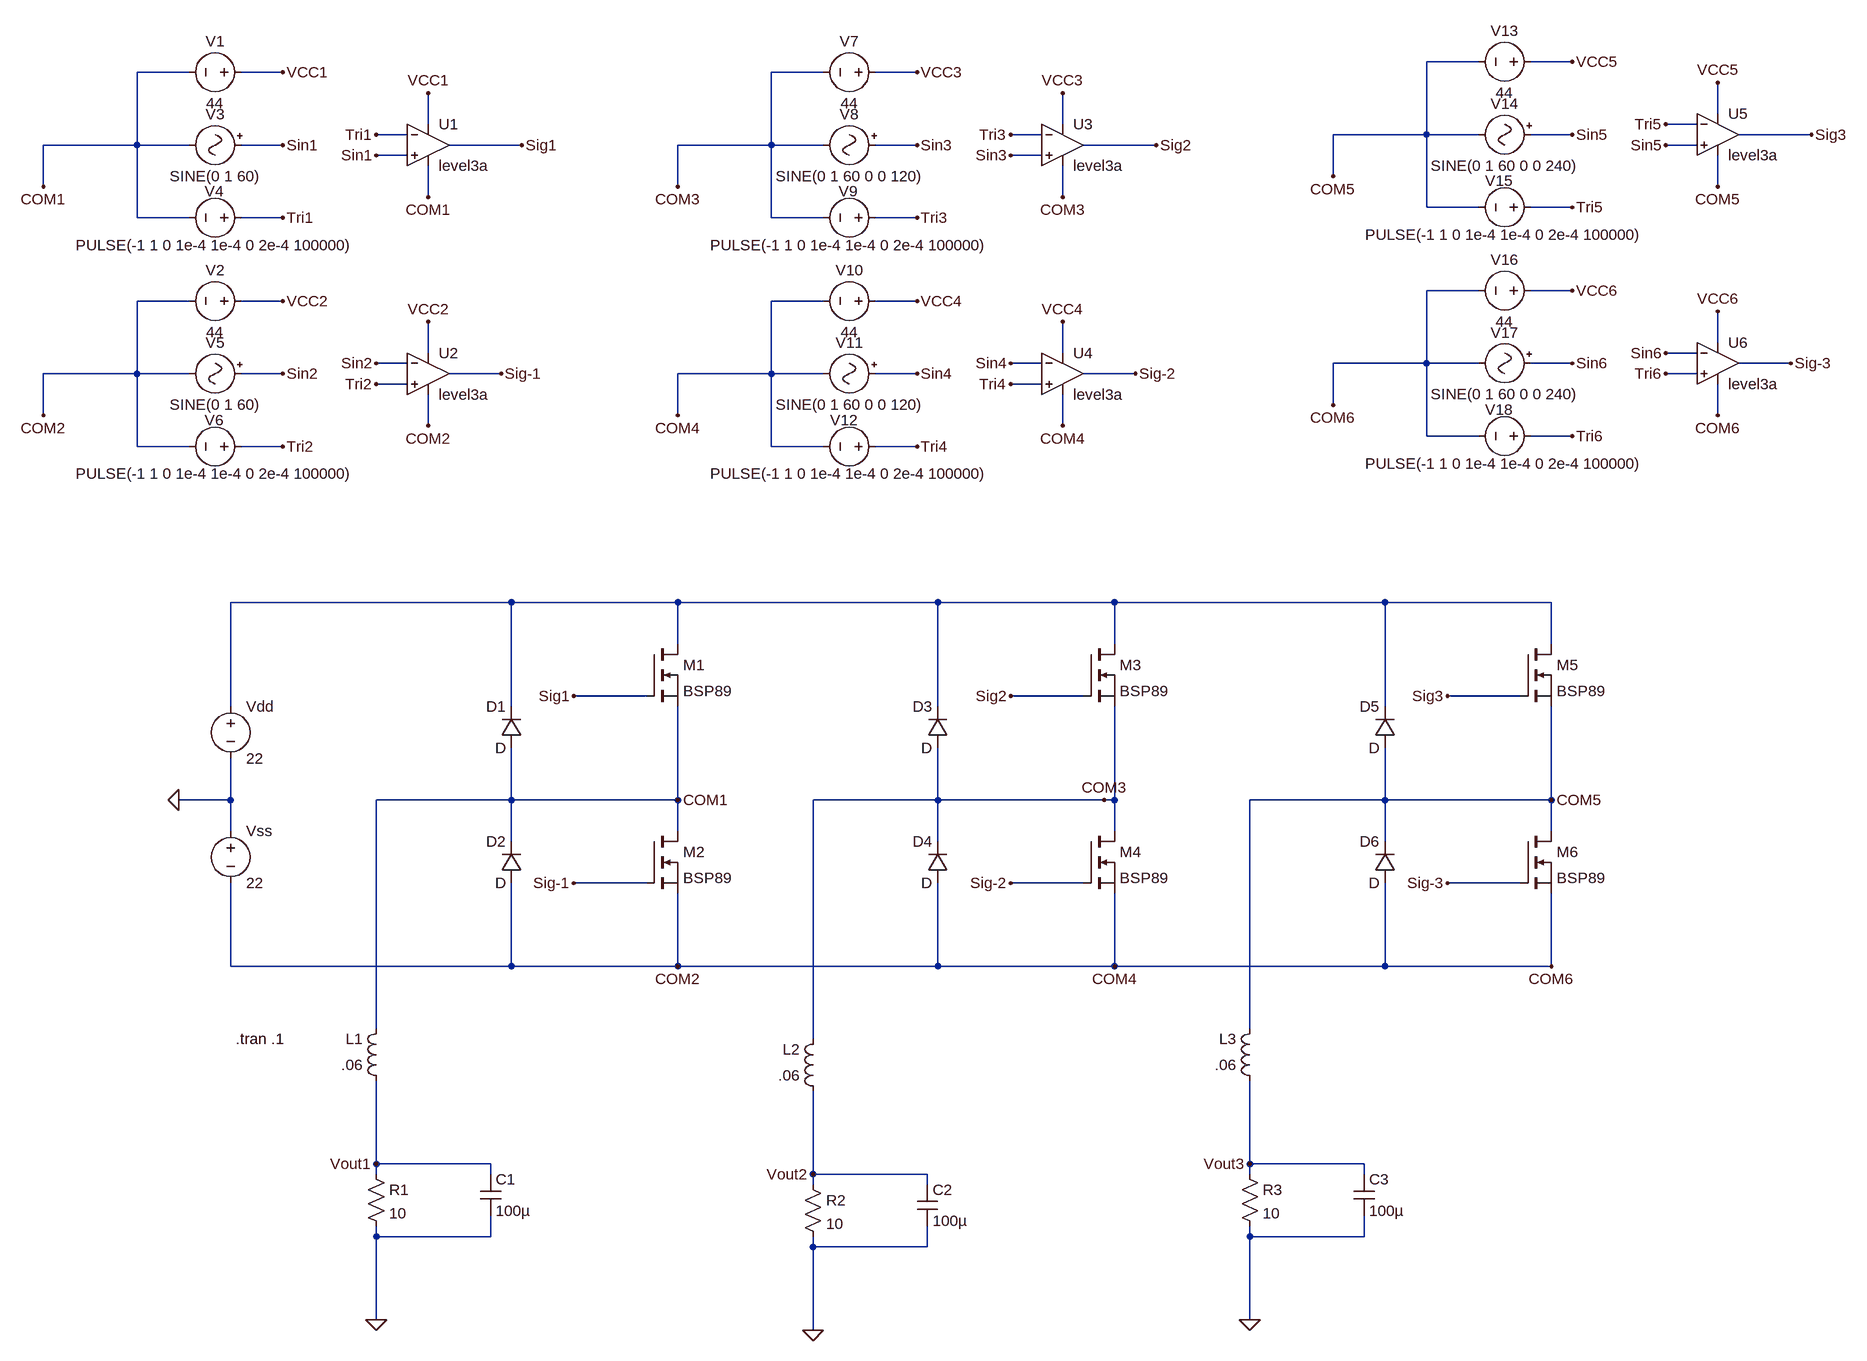
[diagram p0: schematic three_phase_inv.asc]
three_phase_inv.asc, the LTspice schematic file:
Version 4
SHEET 1 2544 2612
WIRE 1824 -528 1744 -528
WIRE 1968 -528 1904 -528
WIRE -160 -512 -240 -512
WIRE -16 -512 -80 -512
WIRE 816 -512 736 -512
WIRE 960 -512 896 -512
WIRE 2192 -448 2192 -496
WIRE 208 -432 208 -480
WIRE 1184 -432 1184 -480
WIRE 2160 -432 2112 -432
WIRE 176 -416 128 -416
WIRE 1152 -416 1104 -416
WIRE 1744 -416 1744 -528
WIRE 1744 -416 1600 -416
WIRE 1824 -416 1744 -416
WIRE 1968 -416 1904 -416
WIRE 2336 -416 2224 -416
WIRE -240 -400 -240 -512
WIRE -240 -400 -384 -400
WIRE -160 -400 -240 -400
WIRE -16 -400 -80 -400
WIRE 352 -400 240 -400
WIRE 736 -400 736 -512
WIRE 736 -400 592 -400
WIRE 816 -400 736 -400
WIRE 960 -400 896 -400
WIRE 1328 -400 1216 -400
WIRE 2160 -400 2112 -400
WIRE 176 -384 128 -384
WIRE 1152 -384 1104 -384
WIRE 1600 -352 1600 -416
WIRE -384 -336 -384 -400
WIRE 592 -336 592 -400
WIRE 2192 -336 2192 -384
WIRE 208 -320 208 -368
WIRE 1184 -320 1184 -368
WIRE 1744 -304 1744 -416
WIRE 1824 -304 1744 -304
WIRE 1968 -304 1904 -304
WIRE -240 -288 -240 -400
WIRE -160 -288 -240 -288
WIRE -16 -288 -80 -288
WIRE 736 -288 736 -400
WIRE 816 -288 736 -288
WIRE 960 -288 896 -288
WIRE 1824 -176 1744 -176
WIRE 1968 -176 1904 -176
WIRE -160 -160 -240 -160
WIRE -16 -160 -80 -160
WIRE 816 -160 736 -160
WIRE 960 -160 896 -160
WIRE 2192 -96 2192 -144
WIRE 208 -80 208 -128
WIRE 1184 -80 1184 -128
WIRE 2160 -80 2112 -80
WIRE 176 -64 128 -64
WIRE 1152 -64 1104 -64
WIRE 1744 -64 1744 -176
WIRE 1744 -64 1600 -64
WIRE 1824 -64 1744 -64
WIRE 1968 -64 1904 -64
WIRE 2304 -64 2224 -64
WIRE -240 -48 -240 -160
WIRE -240 -48 -384 -48
WIRE -160 -48 -240 -48
WIRE -16 -48 -80 -48
WIRE 320 -48 240 -48
WIRE 736 -48 736 -160
WIRE 736 -48 592 -48
WIRE 816 -48 736 -48
WIRE 960 -48 896 -48
WIRE 1296 -48 1216 -48
WIRE 2160 -48 2112 -48
WIRE 176 -32 128 -32
WIRE 1152 -32 1104 -32
WIRE 1600 0 1600 -64
WIRE -384 16 -384 -48
WIRE 592 16 592 -48
WIRE 2192 16 2192 -32
WIRE 208 32 208 -16
WIRE 1184 32 1184 -16
WIRE 1744 48 1744 -64
WIRE 1824 48 1744 48
WIRE 1968 48 1904 48
WIRE -240 64 -240 -48
WIRE -160 64 -240 64
WIRE -16 64 -80 64
WIRE 736 64 736 -48
WIRE 816 64 736 64
WIRE 960 64 896 64
WIRE 336 304 -96 304
WIRE 592 304 336 304
WIRE 992 304 592 304
WIRE 1264 304 992 304
WIRE 1680 304 1264 304
WIRE 1936 304 1680 304
WIRE 592 368 592 304
WIRE 1264 368 1264 304
WIRE 1936 368 1936 304
WIRE 544 448 432 448
WIRE 1216 448 1104 448
WIRE 1888 448 1776 448
WIRE -96 464 -96 304
WIRE 336 464 336 304
WIRE 992 464 992 304
WIRE 1680 464 1680 304
WIRE -96 608 -96 544
WIRE -96 608 -176 608
WIRE 336 608 336 528
WIRE 336 608 128 608
WIRE 592 608 592 464
WIRE 592 608 336 608
WIRE 992 608 992 528
WIRE 992 608 800 608
WIRE 1248 608 992 608
WIRE 1264 608 1264 464
WIRE 1264 608 1248 608
WIRE 1680 608 1680 528
WIRE 1680 608 1472 608
WIRE 1936 608 1936 464
WIRE 1936 608 1680 608
WIRE -96 656 -96 608
WIRE 592 656 592 608
WIRE 1264 656 1264 608
WIRE 1936 656 1936 608
WIRE 336 672 336 608
WIRE 992 672 992 608
WIRE 1680 672 1680 608
WIRE 544 736 432 736
WIRE 1216 736 1104 736
WIRE 1888 736 1776 736
WIRE -96 864 -96 736
WIRE 336 864 336 736
WIRE 336 864 -96 864
WIRE 592 864 592 752
WIRE 592 864 336 864
WIRE 992 864 992 736
WIRE 992 864 592 864
WIRE 1264 864 1264 752
WIRE 1264 864 992 864
WIRE 1680 864 1680 736
WIRE 1680 864 1264 864
WIRE 1936 864 1936 752
WIRE 1936 864 1680 864
WIRE 128 960 128 608
WIRE 1472 960 1472 608
WIRE 800 976 800 608
WIRE 128 1168 128 1040
WIRE 304 1168 128 1168
WIRE 1472 1168 1472 1040
WIRE 1648 1168 1472 1168
WIRE 128 1184 128 1168
WIRE 304 1184 304 1168
WIRE 800 1184 800 1056
WIRE 976 1184 800 1184
WIRE 1472 1184 1472 1168
WIRE 1648 1184 1648 1168
WIRE 800 1200 800 1184
WIRE 976 1200 976 1184
WIRE 128 1280 128 1264
WIRE 304 1280 304 1248
WIRE 304 1280 128 1280
WIRE 1472 1280 1472 1264
WIRE 1648 1280 1648 1248
WIRE 1648 1280 1472 1280
WIRE 800 1296 800 1280
WIRE 976 1296 976 1264
WIRE 976 1296 800 1296
WIRE 128 1408 128 1280
WIRE 1472 1408 1472 1280
WIRE 800 1424 800 1296
FLAG -176 608 0
FLAG 128 -384 Sin1
FLAG 128 -416 Tri1
FLAG 128 -32 Tri2
FLAG 128 -64 Sin2
FLAG 352 -400 Sig1
FLAG 320 -48 Sig-1
FLAG 208 -480 VCC1
FLAG 208 -128 VCC2
FLAG 208 -320 COM1
FLAG 208 32 COM2
FLAG 592 608 COM1
FLAG 592 864 COM2
FLAG -16 -512 VCC1
FLAG -16 -400 Sin1
FLAG -16 -288 Tri1
FLAG -384 -336 COM1
FLAG 128 1168 Vout1
FLAG -16 -160 VCC2
FLAG -16 -48 Sin2
FLAG -16 64 Tri2
FLAG -384 16 COM2
FLAG 432 448 Sig1
FLAG 432 736 Sig-1
FLAG 1104 448 Sig2
FLAG 1104 736 Sig-2
FLAG 1776 448 Sig3
FLAG 1776 736 Sig-3
FLAG 128 1408 0
FLAG 800 1184 Vout2
FLAG 800 1424 0
FLAG 1472 1168 Vout3
FLAG 1472 1408 0
FLAG 1104 -384 Sin3
FLAG 1104 -416 Tri3
FLAG 1104 -32 Tri4
FLAG 1104 -64 Sin4
FLAG 1328 -400 Sig2
FLAG 1296 -48 Sig-2
FLAG 1184 -480 VCC3
FLAG 1184 -128 VCC4
FLAG 1184 -320 COM3
FLAG 1184 32 COM4
FLAG 960 -512 VCC3
FLAG 960 -400 Sin3
FLAG 960 -288 Tri3
FLAG 592 -336 COM3
FLAG 960 -160 VCC4
FLAG 960 -48 Sin4
FLAG 960 64 Tri4
FLAG 592 16 COM4
FLAG 2112 -400 Sin5
FLAG 2112 -432 Tri5
FLAG 2112 -48 Tri6
FLAG 2112 -80 Sin6
FLAG 2336 -416 Sig3
FLAG 2304 -64 Sig-3
FLAG 2192 -496 VCC5
FLAG 2192 -144 VCC6
FLAG 2192 -336 COM5
FLAG 2192 16 COM6
FLAG 1968 -528 VCC5
FLAG 1968 -416 Sin5
FLAG 1968 -304 Tri5
FLAG 1600 -352 COM5
FLAG 1968 -176 VCC6
FLAG 1968 -64 Sin6
FLAG 1968 48 Tri6
FLAG 1600 0 COM6
FLAG 1248 608 COM3
FLAG 1264 864 COM4
FLAG 1936 608 COM5
FLAG 1936 864 COM6
SYMBOL voltage -96 448 R0
SYMATTR InstName Vdd
SYMATTR Value 22
SYMBOL voltage -96 640 R0
SYMATTR InstName Vss
SYMATTR Value 22
SYMBOL Diode 352 528 R180
WINDOW 0 24 64 Left 2
WINDOW 3 24 0 Left 2
SYMATTR InstName D1
SYMBOL Diode 352 736 R180
WINDOW 0 24 64 Left 2
WINDOW 3 24 0 Left 2
SYMATTR InstName D2
SYMBOL nmos 544 368 R0
SYMATTR InstName M1
SYMATTR Value BSP89
SYMBOL nmos 544 656 R0
SYMATTR InstName M2
SYMATTR Value BSP89
SYMBOL Res 112 1168 R0
SYMATTR InstName R1
SYMATTR Value 10
SYMBOL ind 144 1056 R180
WINDOW 0 36 80 Left 2
WINDOW 3 36 40 Left 2
SYMATTR InstName L1
SYMATTR Value .06
SYMBOL cap 288 1184 R0
SYMATTR InstName C1
SYMATTR Value 100µ
SYMBOL voltage -64 -512 R90
WINDOW 0 -32 56 VBottom 2
WINDOW 3 32 56 VTop 2
WINDOW 123 0 0 Left 0
WINDOW 39 0 0 Left 0
SYMATTR InstName V1
SYMATTR Value 44
SYMBOL signal -64 -400 R90
WINDOW 0 -32 56 VBottom 2
WINDOW 3 32 56 VTop 2
WINDOW 123 0 0 Left 0
WINDOW 39 0 0 Left 0
SYMATTR InstName V3
SYMATTR Value SINE(0 1 60)
SYMBOL voltage -64 -288 R90
WINDOW 123 0 0 Left 0
WINDOW 39 0 0 Left 0
WINDOW 0 -41 43 VRight 2
WINDOW 3 42 -161 VRight 2
SYMATTR InstName V4
SYMATTR Value PULSE(-1 1 0 1e-4 1e-4 0 2e-4 100000)
SYMBOL voltage -64 -160 R90
WINDOW 0 -32 56 VBottom 2
WINDOW 3 32 56 VTop 2
WINDOW 123 0 0 Left 0
WINDOW 39 0 0 Left 0
SYMATTR InstName V2
SYMATTR Value 44
SYMBOL signal -64 -48 R90
WINDOW 0 -32 56 VBottom 2
WINDOW 3 32 56 VTop 2
WINDOW 123 0 0 Left 0
WINDOW 39 0 0 Left 0
SYMATTR InstName V5
SYMATTR Value SINE(0 1 60)
SYMBOL voltage -64 64 R90
WINDOW 123 0 0 Left 0
WINDOW 39 0 0 Left 0
WINDOW 0 -41 43 VRight 2
WINDOW 3 42 -161 VRight 2
SYMATTR InstName V6
SYMATTR Value PULSE(-1 1 0 1e-4 1e-4 0 2e-4 100000)
SYMBOL OpAmps/UniversalOpAmp3 208 -400 R0
SYMATTR InstName U1
SYMBOL OpAmps/UniversalOpAmp3 208 -48 R0
SYMATTR InstName U2
SYMBOL nmos 1216 368 R0
SYMATTR InstName M3
SYMATTR Value BSP89
SYMBOL nmos 1216 656 R0
SYMATTR InstName M4
SYMATTR Value BSP89
SYMBOL nmos 1888 368 R0
SYMATTR InstName M5
SYMATTR Value BSP89
SYMBOL nmos 1888 656 R0
SYMATTR InstName M6
SYMATTR Value BSP89
SYMBOL Diode 1008 528 R180
WINDOW 0 24 64 Left 2
WINDOW 3 24 0 Left 2
SYMATTR InstName D3
SYMBOL Diode 1008 736 R180
WINDOW 0 24 64 Left 2
WINDOW 3 24 0 Left 2
SYMATTR InstName D4
SYMBOL Diode 1696 528 R180
WINDOW 0 24 64 Left 2
WINDOW 3 24 0 Left 2
SYMATTR InstName D5
SYMBOL Diode 1696 736 R180
WINDOW 0 24 64 Left 2
WINDOW 3 24 0 Left 2
SYMATTR InstName D6
SYMBOL Res 784 1184 R0
SYMATTR InstName R2
SYMATTR Value 10
SYMBOL ind 816 1072 R180
WINDOW 0 36 80 Left 2
WINDOW 3 36 40 Left 2
SYMATTR InstName L2
SYMATTR Value .06
SYMBOL cap 960 1200 R0
SYMATTR InstName C2
SYMATTR Value 100µ
SYMBOL Res 1456 1168 R0
SYMATTR InstName R3
SYMATTR Value 10
SYMBOL ind 1488 1056 R180
WINDOW 0 36 80 Left 2
WINDOW 3 36 40 Left 2
SYMATTR InstName L3
SYMATTR Value .06
SYMBOL cap 1632 1184 R0
SYMATTR InstName C3
SYMATTR Value 100µ
SYMBOL voltage 912 -512 R90
WINDOW 0 -32 56 VBottom 2
WINDOW 3 32 56 VTop 2
WINDOW 123 0 0 Left 0
WINDOW 39 0 0 Left 0
SYMATTR InstName V7
SYMATTR Value 44
SYMBOL signal 912 -400 R90
WINDOW 0 -32 56 VBottom 2
WINDOW 3 32 56 VTop 2
WINDOW 123 0 0 Left 0
WINDOW 39 0 0 Left 0
SYMATTR InstName V8
SYMATTR Value SINE(0 1 60 0 0 120)
SYMBOL voltage 912 -288 R90
WINDOW 123 0 0 Left 0
WINDOW 39 0 0 Left 0
WINDOW 0 -41 43 VRight 2
WINDOW 3 42 -161 VRight 2
SYMATTR InstName V9
SYMATTR Value PULSE(-1 1 0 1e-4 1e-4 0 2e-4 100000)
SYMBOL voltage 912 -160 R90
WINDOW 0 -32 56 VBottom 2
WINDOW 3 32 56 VTop 2
WINDOW 123 0 0 Left 0
WINDOW 39 0 0 Left 0
SYMATTR InstName V10
SYMATTR Value 44
SYMBOL signal 912 -48 R90
WINDOW 0 -32 56 VBottom 2
WINDOW 3 32 56 VTop 2
WINDOW 123 0 0 Left 0
WINDOW 39 0 0 Left 0
SYMATTR InstName V11
SYMATTR Value SINE(0 1 60 0 0 120)
SYMBOL voltage 912 64 R90
WINDOW 123 0 0 Left 0
WINDOW 39 0 0 Left 0
WINDOW 0 -41 43 VRight 2
WINDOW 3 42 -161 VRight 2
SYMATTR InstName V12
SYMATTR Value PULSE(-1 1 0 1e-4 1e-4 0 2e-4 100000)
SYMBOL OpAmps/UniversalOpAmp3 1184 -400 R0
SYMATTR InstName U3
SYMBOL OpAmps/UniversalOpAmp3 1184 -48 R0
SYMATTR InstName U4
SYMBOL voltage 1920 -528 R90
WINDOW 0 -32 56 VBottom 2
WINDOW 3 32 56 VTop 2
WINDOW 123 0 0 Left 0
WINDOW 39 0 0 Left 0
SYMATTR InstName V13
SYMATTR Value 44
SYMBOL signal 1920 -416 R90
WINDOW 0 -32 56 VBottom 2
WINDOW 3 32 56 VTop 2
WINDOW 123 0 0 Left 0
WINDOW 39 0 0 Left 0
SYMATTR InstName V14
SYMATTR Value SINE(0 1 60 0 0 240)
SYMBOL voltage 1920 -304 R90
WINDOW 123 0 0 Left 0
WINDOW 39 0 0 Left 0
WINDOW 0 -41 43 VRight 2
WINDOW 3 42 -161 VRight 2
SYMATTR InstName V15
SYMATTR Value PULSE(-1 1 0 1e-4 1e-4 0 2e-4 100000)
SYMBOL voltage 1920 -176 R90
WINDOW 0 -32 56 VBottom 2
WINDOW 3 32 56 VTop 2
WINDOW 123 0 0 Left 0
WINDOW 39 0 0 Left 0
SYMATTR InstName V16
SYMATTR Value 44
SYMBOL signal 1920 -64 R90
WINDOW 0 -32 56 VBottom 2
WINDOW 3 32 56 VTop 2
WINDOW 123 0 0 Left 0
WINDOW 39 0 0 Left 0
SYMATTR InstName V17
SYMATTR Value SINE(0 1 60 0 0 240)
SYMBOL voltage 1920 48 R90
WINDOW 123 0 0 Left 0
WINDOW 39 0 0 Left 0
WINDOW 0 -41 43 VRight 2
WINDOW 3 42 -161 VRight 2
SYMATTR InstName V18
SYMATTR Value PULSE(-1 1 0 1e-4 1e-4 0 2e-4 100000)
SYMBOL OpAmps/UniversalOpAmp3 2192 -416 R0
SYMATTR InstName U5
SYMBOL OpAmps/UniversalOpAmp3 2192 -64 R0
SYMATTR InstName U6
TEXT -88 976 Left 2 !.tran .1

The netlist it stands for:
* three_phase_inv.asc
Vdd N001 0 22
Vss 0 COM6 22
D1 COM1 N001 D
D2 COM6 COM1 D
M1 N001 Sig1 COM1 COM1 BSP89
M2 COM1 Sig-1 COM6 COM6 BSP89
R1 Vout1 0 10
L1 Vout1 COM1 .06
C1 Vout1 0 100µ
V1 VCC1 COM1 44
V3 Sin1 COM1 SINE(0 1 60)
V4 Tri1 COM1 PULSE(-1 1 0 1e-4 1e-4 0 2e-4 100000)
V2 VCC2 COM6 44
V5 Sin2 COM6 SINE(0 1 60)
V6 Tri2 COM6 PULSE(-1 1 0 1e-4 1e-4 0 2e-4 100000)
XU1 Sin1 Tri1 VCC1 COM1 Sig1 level3a  ; pins In+ In- V+ V- OUT
XU2 Tri2 Sin2 VCC2 COM6 Sig-1 level3a  ; pins In+ In- V+ V- OUT
M3 N001 Sig2 COM3 COM3 BSP89
M4 COM3 Sig-2 COM6 COM6 BSP89
M5 N001 Sig3 COM5 COM5 BSP89
M6 COM5 Sig-3 COM6 COM6 BSP89
D3 COM3 N001 D
D4 COM6 COM3 D
D5 COM5 N001 D
D6 COM6 COM5 D
R2 Vout2 0 10
L2 Vout2 COM3 .06
C2 Vout2 0 100µ
R3 Vout3 0 10
L3 Vout3 COM5 .06
C3 Vout3 0 100µ
V7 VCC3 COM3 44
V8 Sin3 COM3 SINE(0 1 60 0 0 120)
V9 Tri3 COM3 PULSE(-1 1 0 1e-4 1e-4 0 2e-4 100000)
V10 VCC4 COM6 44
V11 Sin4 COM6 SINE(0 1 60 0 0 120)
V12 Tri4 COM6 PULSE(-1 1 0 1e-4 1e-4 0 2e-4 100000)
XU3 Sin3 Tri3 VCC3 COM3 Sig2 level3a  ; pins In+ In- V+ V- OUT
XU4 Tri4 Sin4 VCC4 COM6 Sig-2 level3a  ; pins In+ In- V+ V- OUT
V13 VCC5 COM5 44
V14 Sin5 COM5 SINE(0 1 60 0 0 240)
V15 Tri5 COM5 PULSE(-1 1 0 1e-4 1e-4 0 2e-4 100000)
V16 VCC6 COM6 44
V17 Sin6 COM6 SINE(0 1 60 0 0 240)
V18 Tri6 COM6 PULSE(-1 1 0 1e-4 1e-4 0 2e-4 100000)
XU5 Sin5 Tri5 VCC5 COM5 Sig3 level3a  ; pins In+ In- V+ V- OUT
XU6 Tri6 Sin6 VCC6 COM6 Sig-3 level3a  ; pins In+ In- V+ V- OUT
.model D D
.lib standard.dio
.model NMOS NMOS
.model PMOS PMOS
.lib standard.mos
.tran .1
.backanno
.end